# Altium schematic sheet PA_AMP.SchDoc: Приемопередатчик  SDR200
size 420 x 297 mm; Author: В.Титов; DrawnBy: В.Титов; DocumentNumber: ХХХХ.468179.001 Э3; SheetNumber: 2; SheetTotal: 2; DocumentType: Схема электрическая принципиальная; Title2: Усилитель мощности; Scale: 1:1
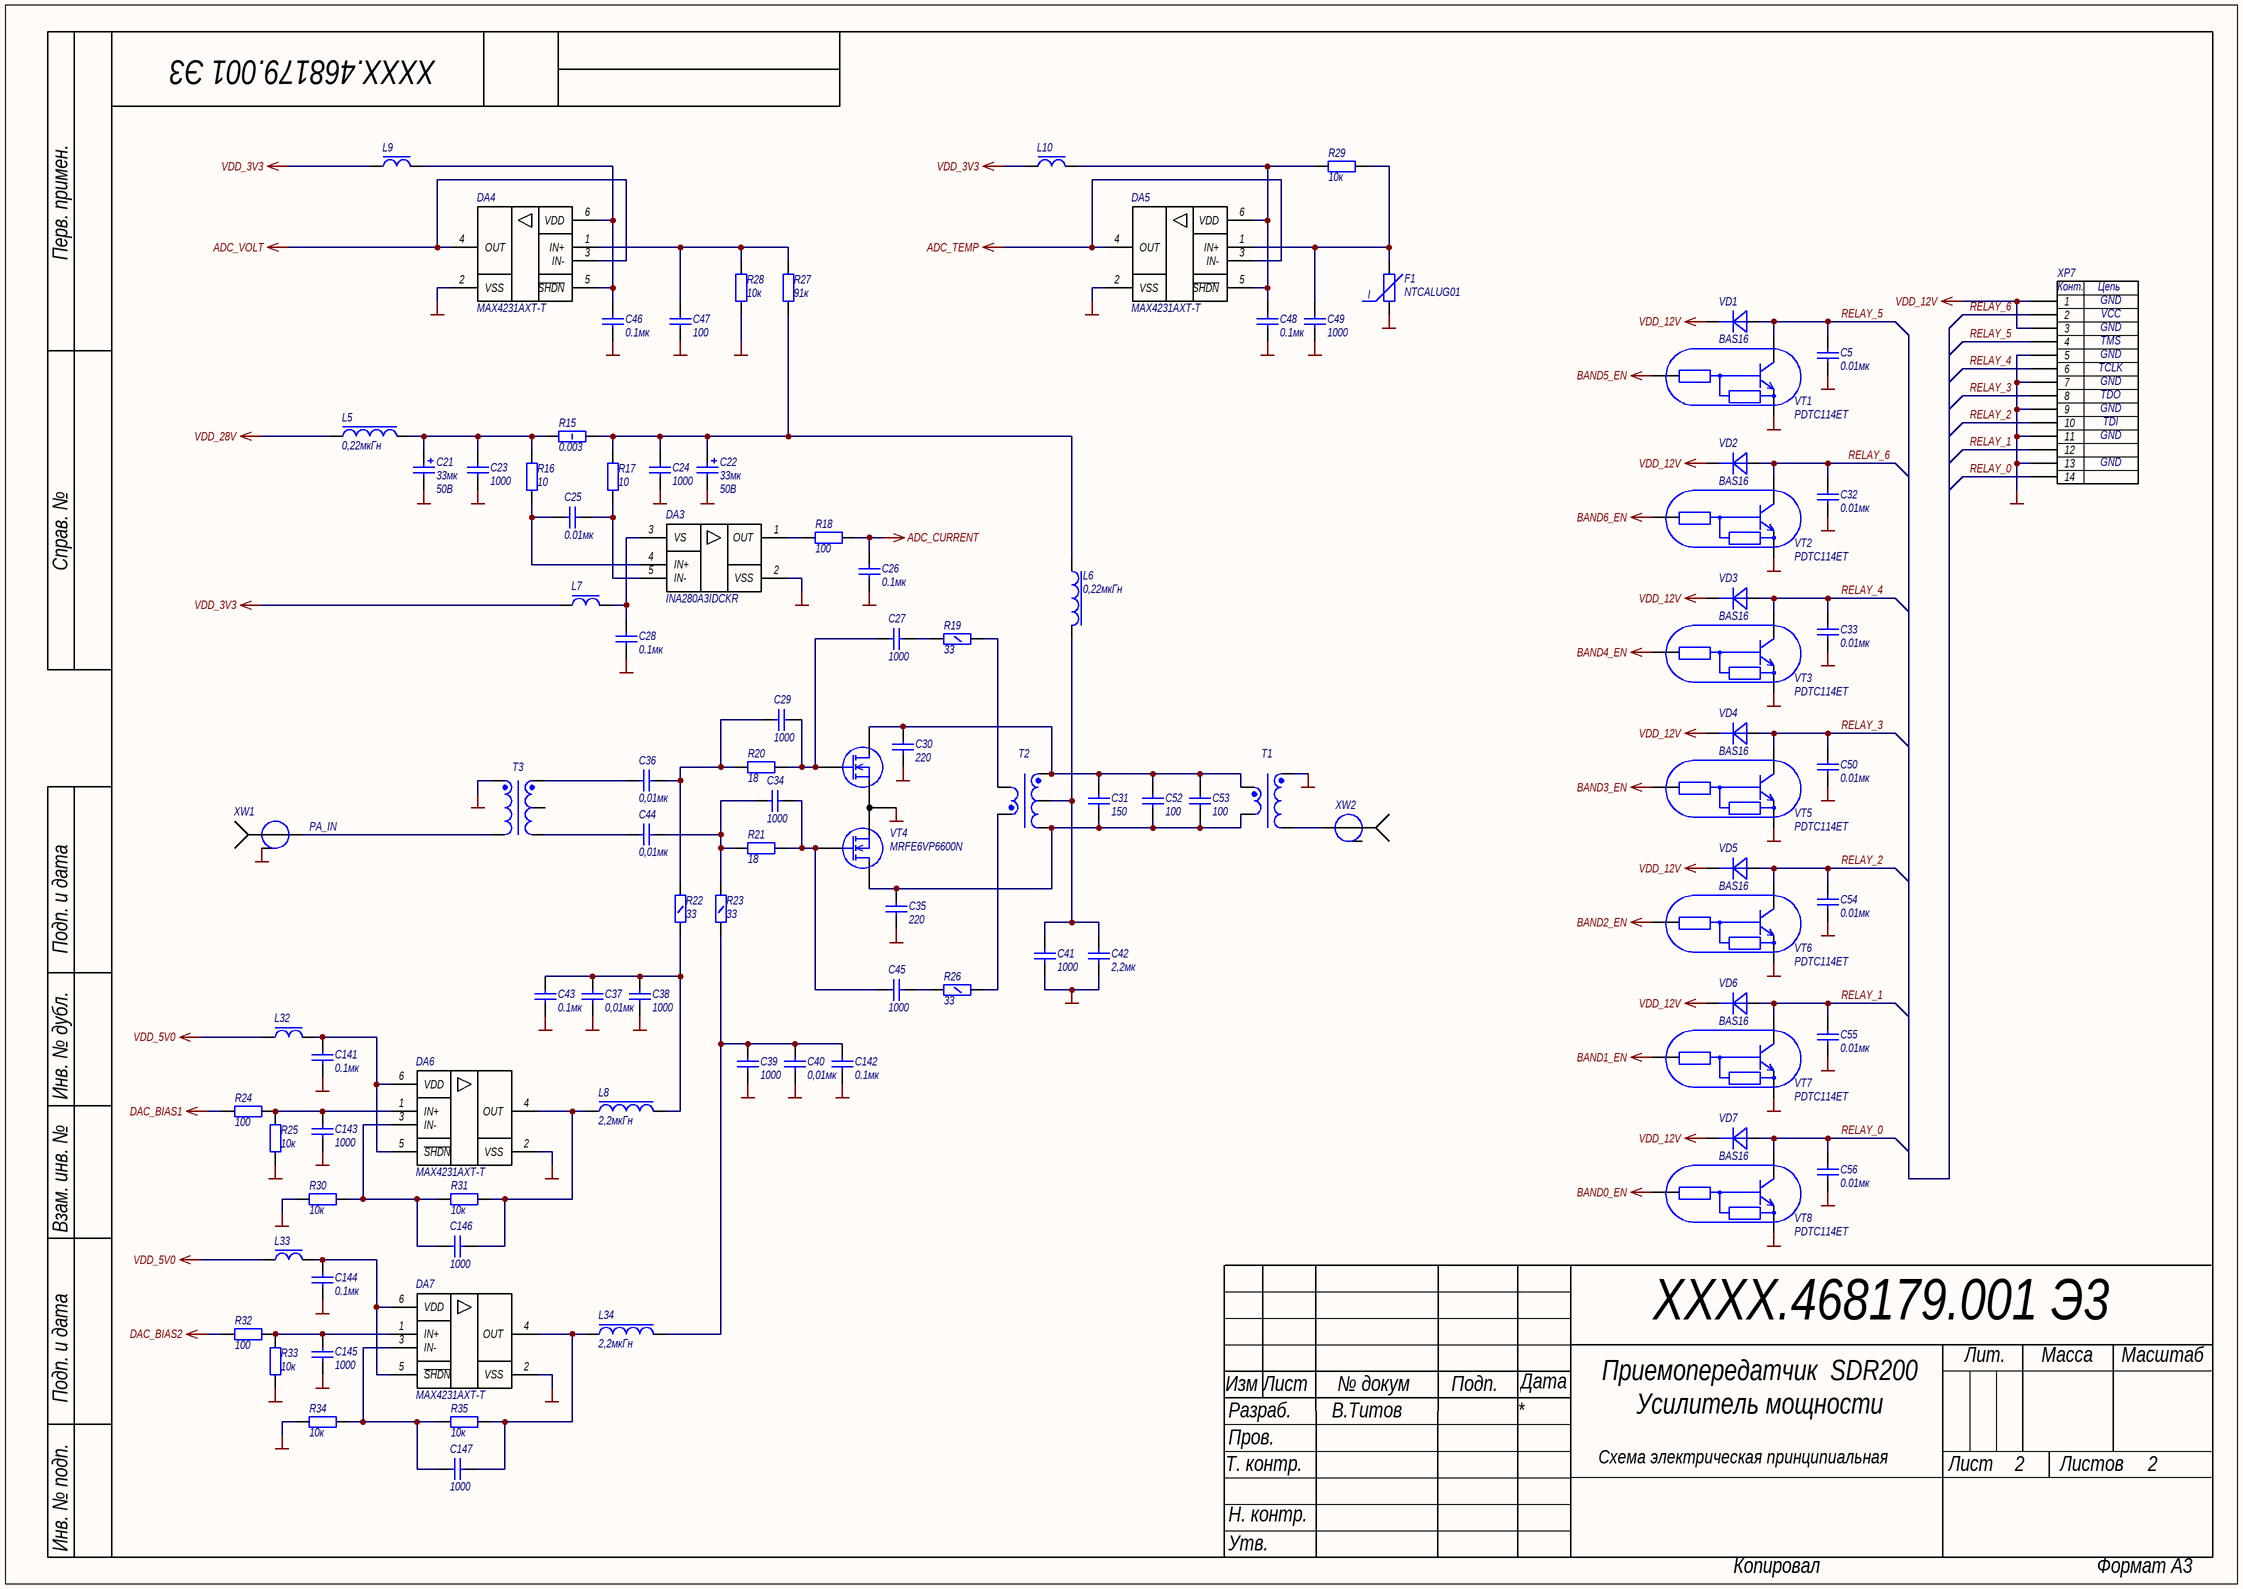
[diagram p0: PA_AMP.SchDoc]

## Parts
C5  0.01мк  [CAPC1005X06N]
C21  Power/Voltage: 50В  [CAPAE7664X77L]  (hidden comment: 33мк)
C22  Power/Voltage: 50В  [CAPAE7664X77L]  (hidden comment: 33мк)
C23  1000  [CAPC2012X12L]
C24  1000  [CAPC2012X12L]
C25  0.01мк  [CAPC1005X06N]
C26  0.1мк  [CAPC1005X06N]
C27  1000  [CAPC3216X19L]
C28  0.1мк  [CAPC1005X06N]
C29  1000  [CAPC2012X12L]
C30  220  [CAPC3216X19L]
C31  150  [CAPC3216X19L]
C32  0.01мк  [CAPC1005X06N]
C33  0.01мк  [CAPC1005X06N]
C34  1000  [CAPC2012X12L]
C35  220  [CAPC3216X19L]
C36  0,01мк  [CAPC2012X12L]
C37  0,01мк  [CAPC2012X12L]
C38  1000  [CAPC2012X12L]
C39  1000  [CAPC2012X12L]
C40  0,01мк  [CAPC2012X12L]
C41  1000  [CAPC3216X19L]
C42  2,2мк  [CAPC3216X19L]
C43  0.1мк  [CAPC1608X08L]
C44  0,01мк  [CAPC2012X12L]
C45  1000  [CAPC3216X19L]
C46  0.1мк  [CAPC1005X06N]
C47  100  [CAPC1005X06N]
C48  0.1мк  [CAPC1005X06N]
C49  1000  [CAPC1005X06N]
C50  0.01мк  [CAPC1005X06N]
C52  100  [CAPC3216X19L]
C53  100  [CAPC3216X19L]
C54  0.01мк  [CAPC1005X06N]
C55  0.01мк  [CAPC1005X06N]
C56  0.01мк  [CAPC1005X06N]
C141  0.1мк  [CAPC1005X06N]
C142  0.1мк  [CAPC1608X08L]
C143  1000  [CAPC1005X06N]
C144  0.1мк  [CAPC1005X06N]
C145  1000  [CAPC1005X06N]
C146  1000  [CAPC1005X06N]
C147  1000  [CAPC1005X06N]
DA3  INA280A3IDCKR  [SOT65P210X110-5L]
DA4  MAX4231AXT-T  [TSOP65P210X100-6L]
DA5  MAX4231AXT-T  [TSOP65P210X100-6L]
DA6  MAX4231AXT-T  [TSOP65P210X100-6L]
DA7  MAX4231AXT-T  [TSOP65P210X100-6L]
F1  NTCALUG01  [NTCALUG01T]
L5  0,22мкГн  [CSAB0530]
L6  0,22мкГн  [CSAB0530]
L7  BLM18PG121SN1D  [INDC1608X08L]  (value not drawn)
L8  2,2мкГн  [CSAB0420]
L9  BLM18PG121SN1D  [INDC1608X08L]  (value not drawn)
L10  BLM18PG121SN1D  [INDC1608X08L]  (value not drawn)
L32  BLM18PG121SN1D  [INDC1608X08L]  (value not drawn)
L33  BLM18PG121SN1D  [INDC1608X08L]  (value not drawn)
L34  2,2мкГн  [CSAB0420]
R15  0.003  [RESC6332X04N]
R16  10  [RESC1005X06N]
R17  10  [RESC1005X06N]
R18  100  [RESC1005X06N]
R19  33  [RESC3216X04L]
R20  18  [RESC2012X05L]
R21  18  [RESC2012X05L]
R22  33  [RESC3216X04L]
R23  33  [RESC3216X04L]
R24  100  [RESC1005X06N]
R25  10к  [RESC1005X06N]
R26  33  [RESC3216X04L]
R27  91к  [RESC1005X06N]
R28  10к  [RESC1005X06N]
R29  10к  [RESC1005X06N]
R30  10к  [RESC1005X06N]
R31  10к  [RESC1005X06N]
R32  100  [RESC1005X06N]
R33  10к  [RESC1005X06N]
R34  10к  [RESC1005X06N]
R35  10к  [RESC1005X06N]
T1  Трансформатор PUM_IN  [TRANSFORMER_KV_PAOUT_400W]  (value not drawn)
T2  Трансформатор PUM_IN  [TRSF_VOLT]  (value not drawn)
T3  Трансформатор PUM_IN  [Transformer_KV_PAIN]  (value not drawn)
VD1  BAS16  [SOT23_N]
VD2  BAS16  [SOT23_N]
VD3  BAS16  [SOT23_N]
VD4  BAS16  [SOT23_N]
VD5  BAS16  [SOT23_N]
VD6  BAS16  [SOT23_N]
VD7  BAS16  [SOT23_N]
VT1  PDTC114ET  [SOT23_N]
VT2  PDTC114ET  [SOT23_N]
VT3  PDTC114ET  [SOT23_N]
VT4  MRFE6VP6600N  [OM-780-4L]
VT5  PDTC114ET  [SOT23_N]
VT6  PDTC114ET  [SOT23_N]
VT7  PDTC114ET  [SOT23_N]
VT8  PDTC114ET  [SOT23_N]
XP7  IDC2-14MS  [IDC2-14MS]  (value not drawn)
XW1  SMA-JR  [SMA-JR]  (value not drawn)
XW2  SMA-JR  [SMA-JR]  (value not drawn)

## Nets
ADC_CURRENT: C26.2 R18.1
ADC_TEMP: DA5.3(IN-) DA5.4(OUT)
ADC_VOLT: DA4.3(IN-) DA4.4(OUT)
BAND0_EN: VT8.1(B)
BAND1_EN: VT7.1(B)
BAND2_EN: VT6.1(B)
BAND3_EN: VT5.1(B)
BAND4_EN: VT3.1(B)
BAND5_EN: VT1.1(B)
BAND6_EN: VT2.1(B)
DAC_BIAS1: R24.1
DAC_BIAS2: R32.1
GND: C5.1 C21.2 C22.2 C23.1 C24.1 C26.1 C28.1 C30.1 C32.1 C33.1 C35.1 C37.1 C38.1 C39.1 C40.1 C41.1 C42.1 C43.1 C46.2 C47.2 C48.2 C49.2 C50.1 C54.1 C55.1 C56.1 C141.1 C142.1 C143.1 C144.1 C145.1 DA3.2(VSS) DA4.2(VSS) DA5.2(VSS) DA6.2(VSS) DA7.2(VSS) F1.2 R25.2 R28.1 R30.1 R33.2 R34.1 T1.3 T3.5(PRIMARY_DOT) VT1.2(E) VT2.2(E) VT3.2(E) VT4.5(S) VT5.2(E) VT6.2(E) VT7.2(E) VT8.2(E) XP7.5 XP7.7 XP7.9 XP7.11 XP7.13 XW1.2
VDD_3V3: L7.1 L9.1 L10.1
VDD_5V0: L32.1 L33.1
VDD_12V: VD1.3(K) VD2.3(K) VD3.3(K) VD4.3(K) VD5.3(K) VD6.3(K) VD7.3(K) XP7.1 XP7.3
VDD_28V: L5.1
RELAY_0: C56.2 VD7.1(A) VT8.3(C) XP7.14
RELAY_1: C55.2 VD6.1(A) VT7.3(C) XP7.12
RELAY_2: C54.2 VD5.1(A) VT6.3(C) XP7.10
RELAY_3: C50.2 VD4.1(A) VT5.3(C) XP7.8
RELAY_4: C33.2 VD3.1(A) VT3.3(C) XP7.6
RELAY_5: C5.2 VD1.1(A) VT1.3(C) XP7.4
RELAY_6: C32.2 VD2.1(A) VT2.3(C) XP7.2
NetC21_1: C21.1 C23.2 L5.2 R15.1 R16.1
NetC22_1: C22.1 C24.2 L6.1 R15.2 R17.1 R27.2
NetC25_1: C25.1 DA3.5(GND) R17.2
NetC25_2: C25.2 DA3.4(IN+) R16.2
NetC27_1: C27.1 R19.1
NetC27_2: C27.2 C29.1 R20.2 VT4.3(GATE)
NetC28_2: C28.2 DA3.3(VS) L7.2
NetC29_2: C29.2 C36.1 R20.1 R22.1
NetC30_2: C30.2 C31.2 C52.2 C53.2 T1.1 T2.1 VT4.1(D)
NetC31_1: C31.1 C35.2 C52.1 C53.1 T1.2 T2.3 VT4.2(D)
NetC34_1: C34.1 C45.2 R21.2 VT4.4(GATE)
NetC34_2: C34.2 C44.1 R21.1 R23.1
NetC36_2: C36.2 T3.1(SECONDARY_DOT)
NetC37_2: C37.2 C38.2 C43.2 L8.2 R22.2
NetC39_2: C39.2 C40.2 C142.2 L34.2 R23.2
NetC41_2: C41.2 C42.2 L6.2 T2.2
NetC44_2: C44.2 T3.3(SECONDARY)
NetC45_1: C45.1 R26.1
NetC46_1: C46.1 DA4.5(GND) DA4.6(VDD) L9.2
NetC47_1: C47.1 DA4.1(IN+) R27.1 R28.2
NetC48_1: C48.1 DA5.5(GND) DA5.6(VDD) L10.2 R29.1
NetC49_1: C49.1 DA5.1(IN+) F1.1 R29.2
NetC141_2: C141.2 DA6.5(GND) DA6.6(VDD) L32.2
NetC143_2: C143.2 DA6.1(IN+) R24.2 R25.1
NetC144_2: C144.2 DA7.5(GND) DA7.6(VDD) L33.2
NetC145_2: C145.2 DA7.1(IN+) R32.2 R33.1
NetC146_1: C146.1 DA6.4(OUT) L8.1 R31.2
NetC146_2: C146.2 DA6.3(IN-) R30.2 R31.1
NetC147_1: C147.1 DA7.4(OUT) L34.1 R35.2
NetC147_2: C147.2 DA7.3(IN-) R34.2 R35.1
NetDA3_1: DA3.1(OUT) R18.2
NetR19_2: R19.2 T2.4(FB)
NetR26_2: R26.2 T2.5(FB)
NetT1_4: T1.4 XW2.1
NetT3_4: T3.4(PRIMARY) XW1.1

Not connected (* = marked no-connect by the designer): T3 2(SECONARY_CT); XW2 2

## Notes on the sheet
- (near XW1) PA_IN
- Перв. примен.
- Справ. №
- Подп. и дата
- Инв. № дубл.
- Взам. инв. №
- Изм
- Лист
- № докум
- Подп.
- Дата
- Лит.
- Масса
- Масштаб
- Т. контр.
- Разраб.
- Пров.
- Листов
- Н. контр.
- Инв. № подп.
- Утв.
- Копировал
- Формат А3
- (in symbol Соединитель IDC2-14MS) Конт.; Цепь; GND; VCC; TMS; TCLK; TDO; TDI
- (in symbol Терморезистор NTCALUG01) I

## Library data of the parts
C5 C25 C32 C33 C50 C54-C56 = Кер.ЧИП конд. 0402 0.01мкФ X7R 10%, 50В: Кер. ЧИП-конденсатор; Power/Voltage: 50В; TKE: X7R; Tolerance: ±20%; Value: 0.01мк
C21 C22 = Конденсатор гибридный SMD 33мкФ ±20% 50В: Гибридный ЧИП-конденсатор; ManufacturerPartNumber: EEHZC1H330XP; Manufacturer: Panasonic; Tolerance: ±20%; Published: 8-Jun-2000; LatestRevisionDate: 29-May-2009; LatestRevisionNote: IPC-7351 Footprint Added.; Publisher: Altium Limited; PackageDescription: ZC Series - Anti-Vibration; PackageReference: ZC Series; Value: 33мк
C23 C24 C29 C34 C38 C39 = Кер.ЧИП конд. 0805 1000пФ X7R 10% 100В: Кер. ЧИП-конденсатор; Manufacturer: WALSIN; ManufacturerPartNumber: 0805B102K100; Power/Voltage: 100В; TKE: X7R; Tolerance: ±10%; Value: 1000
C26 C28 C46 C48 C141 C144 = Кер.ЧИП конд. 0402 0.1мкФ X7R 10%, 16В: Кер. ЧИП-конденсатор; Power/Voltage: 16В; TKE: X7R; Tolerance: ±10%; PackageReference: 0402; Value: 0.1мк
C27 C41 C45 = Кер.ЧИП конд. 1206 1000пФ X7К 10% 2000В: Кер. ЧИП-конденсатор; Manufacturer: Johanson; ManufacturerPartNumber: 202R18W102KV4E; Power/Voltage: 2000В; TKE: X7R; Tolerance: ±10%; Value: 1000
C30 C35 C52 C53 = Кер.ЧИП конд. 1206 220пФ NP0 5% 2000В: Кер. ЧИП-конденсатор; Manufacturer: Johanson; ManufacturerPartNumber: 202R18W102KV4E; Power/Voltage: 2000В; TKE: X7R; Tolerance: ±10%
  C30 C35: Value: 220
  C52 C53: Value: 100
C31 = Кер.ЧИП конд. 1206 150пФ NP0 5% 2000В: Кер. ЧИП-конденсатор; Manufacturer: Johanson; ManufacturerPartNumber: 202R18W102KV4E; Power/Voltage: 2000В; TKE: X7R; Tolerance: ±10%; Value: 150
C36 C37 C40 C44 = Кер.ЧИП конд. 0805 0,01 мкФ X7R 10% 250В: Кер. ЧИП-конденсатор; Manufacturer: Murate; ManufacturerPartNumber: GRM21BR72E103KW03; Power/Voltage: 250В; TKE: X7R; Tolerance: ±10%; Value: 0,01мк
C42 = Кер.ЧИП конд. 1206 2,2мкФ X7R 10% 100В: Кер. ЧИП-конденсатор; Manufacturer: Murata; ManufacturerPartNumber: GRM31CR72A225KA73L; Power/Voltage: 100В; TKE: X7R; Tolerance: ±10%; Value: 2,2мк
C43 C142 = Кер.ЧИП конд. 0603 0.1мкФ X7R 10% 50В: Кер. ЧИП-конденсатор; Manufacturer: Murata; ManufacturerPartNumber: GRM188R71H104KA93D; Power/Voltage: 50В; TKE: X7R; Tolerance: ±10%; Value: 0.1мк
C47 = Кер.ЧИП конд. 0402 100пФ NPO 5%, 50В: Кер. ЧИП-конденсатор; Power/Voltage: 50В; TKE: NPO; Tolerance: ±5%; PackageReference: 0402; Value: 100
C49 C143 C145-C147 = Кер.ЧИП конд. 0402 1000пФ NP0 5%, 50В: Кер. ЧИП-конденсатор; Power/Voltage: 50В; TKE: NPO; Tolerance: ±5%; PackageReference: 0402; Value: 1000
DA3 = Микросхема INA280A3IDCKR: 2.7-V to 120-V, 1.1-MHz, High Precision Current Sense Amplifier in Small / (SC-70) Package; Manufacturer: TI; Value: INA280A3IDCKR; ComponentLink1Description: datasheet; ComponentLink1URL: https://datasheets.maximintegrated.com/en/ds/MAX4230-MAX4234.pdf
DA4-DA7 = Микросхема MAX4231AXT-T: High-Output-Drive, 10MHz, 10V/μs,  Rail-to-Rail I/O Op Amps with Shutdown in SC70; Manufacturer: MAXIM; Value: MAX4231AXT-T; ComponentLink1Description: datasheet; ComponentLink1URL: https://datasheets.maximintegrated.com/en/ds/MAX4230-MAX4234.pdf
F1 = Терморезистор NTCALUG01: ЧИП-резистор; Value: NTCALUG01
L5 L6 = ЧИП индуктивность CDCSAB0530-R22M: 0.22мкГн, 19А, 5.2х5.0х3мм, Катушка индуктивности SMD; Manufacturer: Vishay; ManufacturerPartNumber: CDCSAB0530-R22M; Value: 0,22мкГн
L7 L9 L10 L32 L33 = ЧИП дроссель 0603 BLM18PG121SN1D: SMD EMI Suppression Filter EMIFIL; Manufacturer: Murata; ManufacturerPartNumber: BLM18PG121SN1D; Value: BLM18PG121SN1D
L8 L34 = ЧИП индуктивность CSAB0420-2R2M: Molding Power Choke; Manufacturer: Vishay; ManufacturerPartNumber: IHLP1616ABER1R0M11; Value: 2,2мкГн
R15 = Чип резистор 2512 0.003Ом, 5%: ЧИП-резистор PA2512FKF070R003E; Tolerance: ±5%; Value: 0.003
R16 R17 = Чип резистор 0402 10 Ом, 5%: ЧИП-резистор; Tolerance: ±5%; TKE: 100 ppm/°С; PackageReference: 0402; Value: 10
R18 R24 R32 = Чип резистор 0402 100 Ом, 5%: ЧИП-резистор; Tolerance: ±5%; TKE: 100 ppm/°С; PackageReference: 0402; Value: 100
R19 R22 R23 R26 = Чип резистор 1206 33 Ом, 5%: ЧИП-резистор; Manufacturer: ROHM; Tolerance: ±5%; TKE: 300 ppm/°С; PackageReference: 1206; Value: 33
R20 R21 = Чип резистор 0805 18 Ом, 5%: ЧИП-резистор; Tolerance: ±5%; TKE: 100 ppm/°С; PackageReference: 0805; Value: 18
R25 R28-R31 R33-R35 = Чип резистор 0402 10 кОм, 5%: ЧИП-резистор; Tolerance: ±5%; TKE: 100 ppm/°С; PackageReference: 0402; Value: 10к
R27 = Чип резистор 0402 91 кОм, 5%: ЧИП-резистор; Tolerance: ±5%; TKE: 100 ppm/°С; PackageReference: 0402; Value: 91к
T1 = Трансформатор PA_OUT
T2 = Трансформатор PA_OUT_VOLT
T3 = Transformer_KV_PA: Трансформатор на бинокле BN-43-302 (2843000302)mu850 / Первичная обмотка - 2 витка проводом МГТФ 0,12 / Вторичная обмотка - 2 витка проводом МГТФ 0,12; Manufacturer: НЕЛС; Manufacturer Part Number: Трансформатор PUM_IN АНЕЛ.671143.002; SubType: Трансформатор бинокле; Package: BN-43-302 (2843000302) 13.3x10.3 mm; Type: Трансформатор
VD1-VD7 = ЧИП диод BAS16: High-speed switching diodes; Manufacturer: Nexperia; Power/Voltage: 100В; ManufacturerPartNumber: BAS16; Value: BAS16; ComponentLink1Description: datasheet; ComponentLink1URL: https://assets.nexperia.com/documents/data-sheet/BAS16_SER.pdf
VT1-VT3 VT5-VT8 = ЧИП транзистор PDTC114ET: NPN resistor-equipped transistors;  R1 = 10 k, R2 = 10; ComponentLink1Description: datasheet; ComponentLink1URL: https://assets.nexperia.com/documents/data-sheet/PDTC114E_SER.pdf; Value: PDTC114ET
VT4 = Транзистор MRFE6VP6600N: RF Power LDMOS Transistors; ComponentLink1Description: datasheet; ComponentLink1URL: https://www.nxp.com/docs/en/data-sheet/MRFE6VP6600N.pdf; Value: MRFE6VP6600N
XP7 = Соединитель IDC2-14MS: JTAG Xilinx IDC2-14MS; Manufacturer: Molex; Value: IDC2-14MS
XW1 XW2 = Соединитель коаксиальный SMA-JR: SMA-JR Разъем SMA гнездо на плату, прямой угол; Value: SMA-JR; ComponentLink1Description: datasheet; ComponentLink1URL: http://www.brownbear.ru/goods/2243.html